# Altium project ESP32.PrjPcb (part 1 of 3)
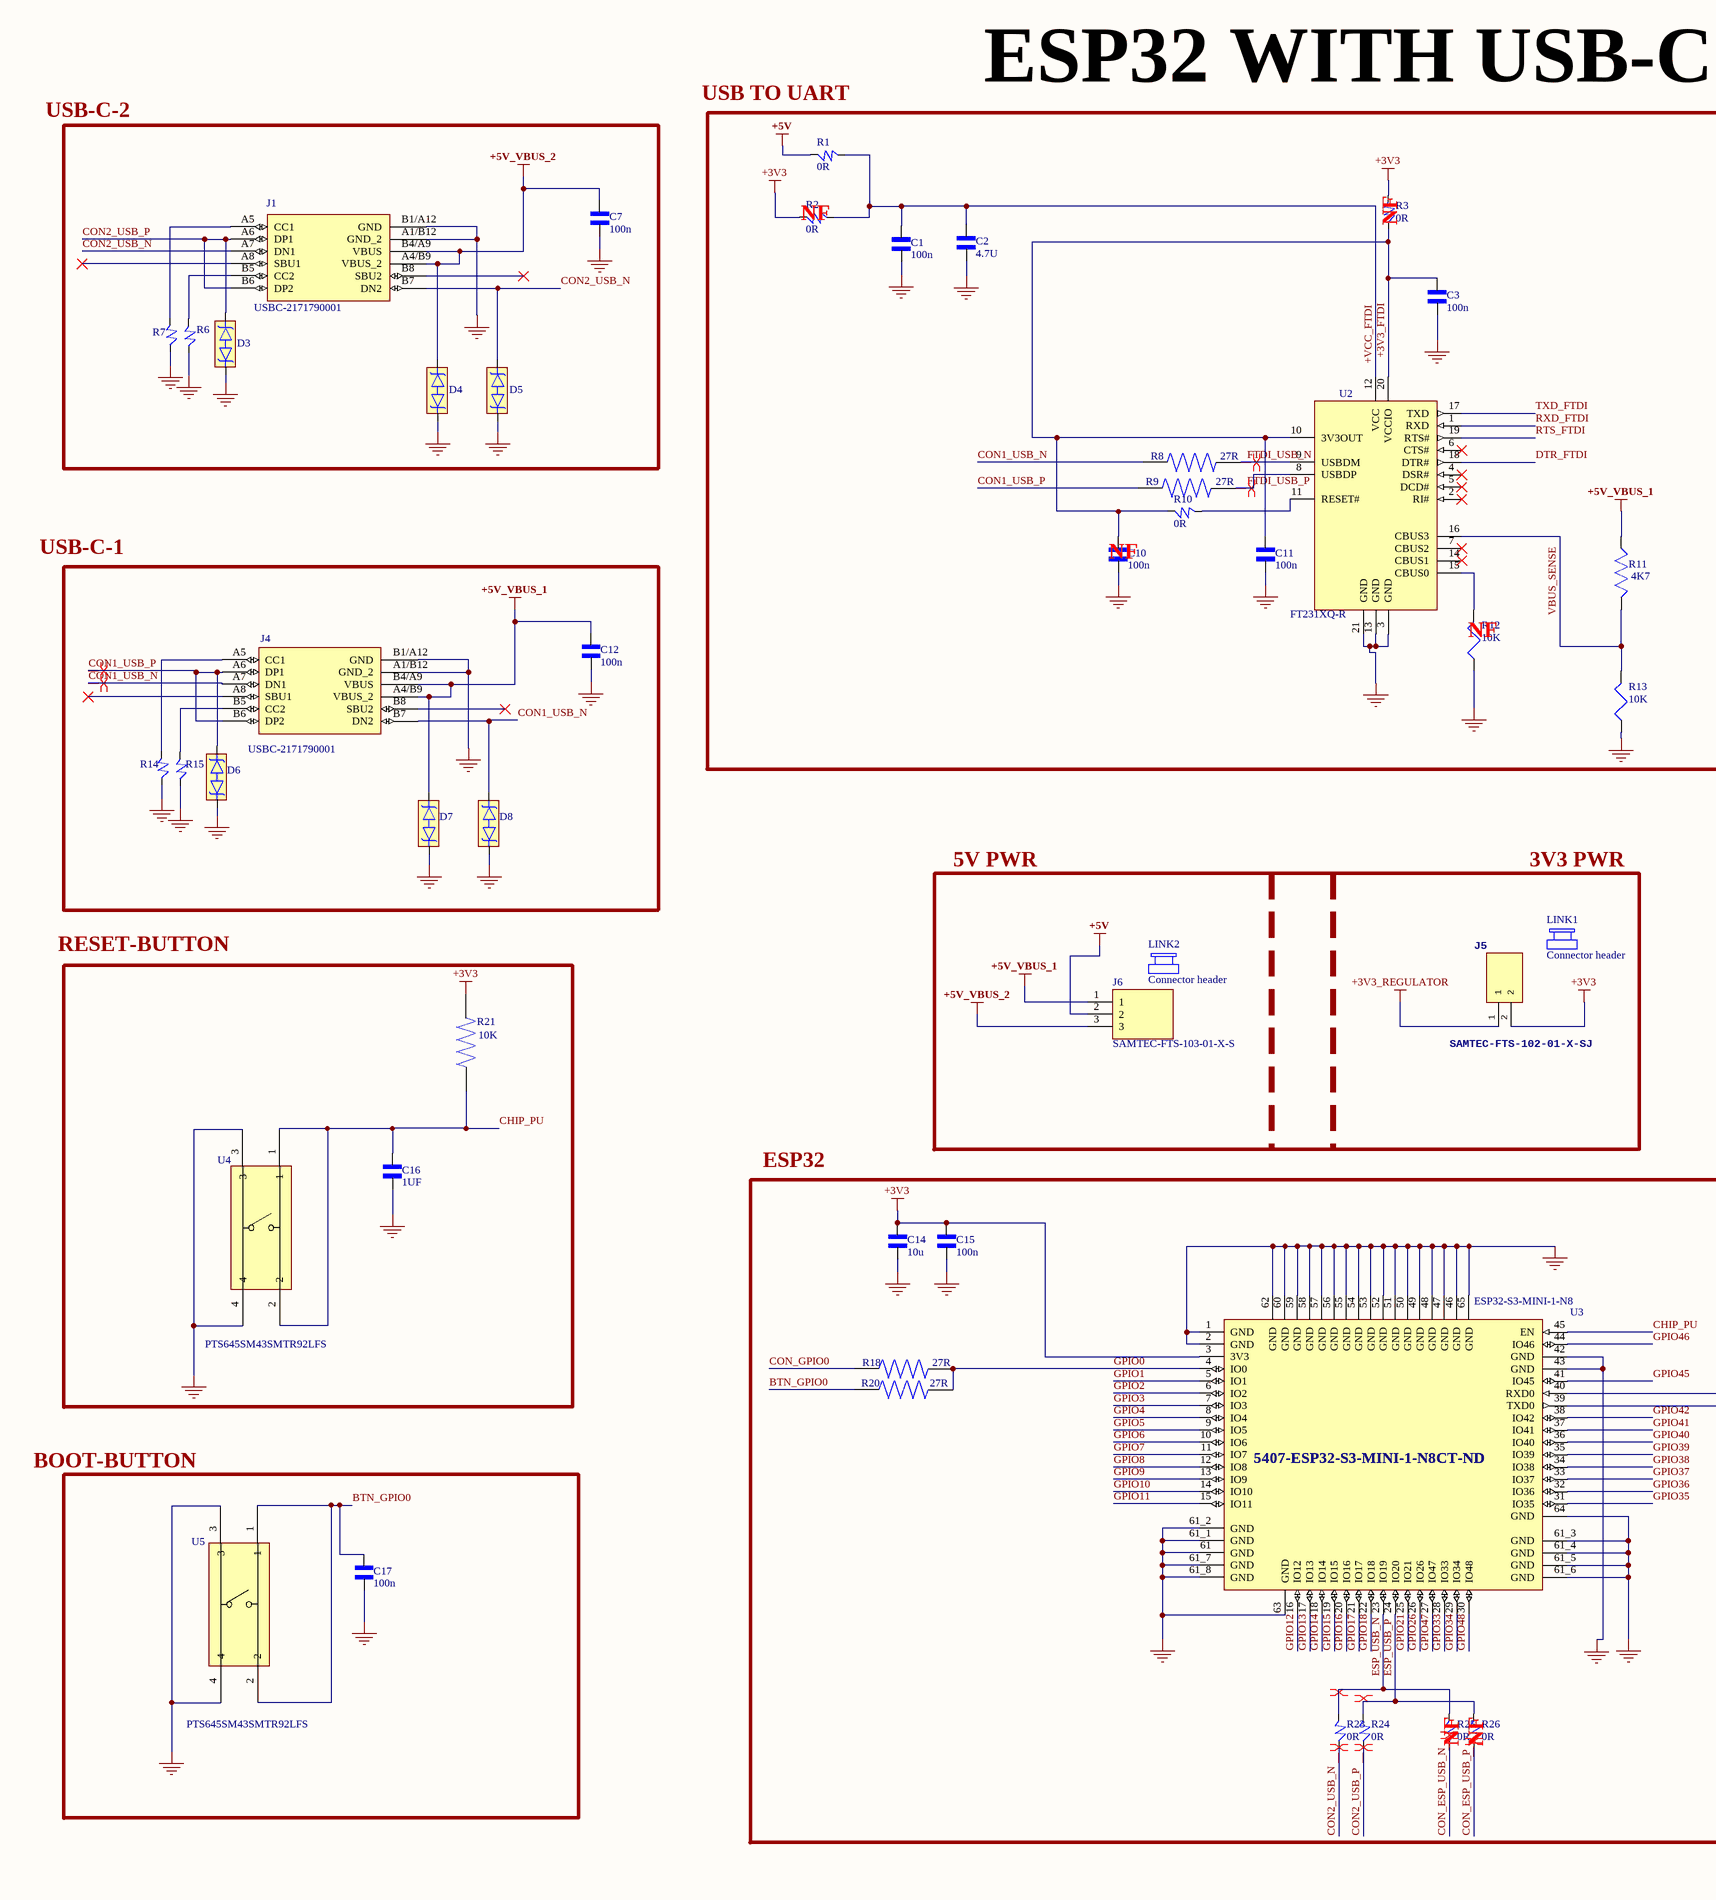
[diagram p0: Sheet1.SchDoc, left]
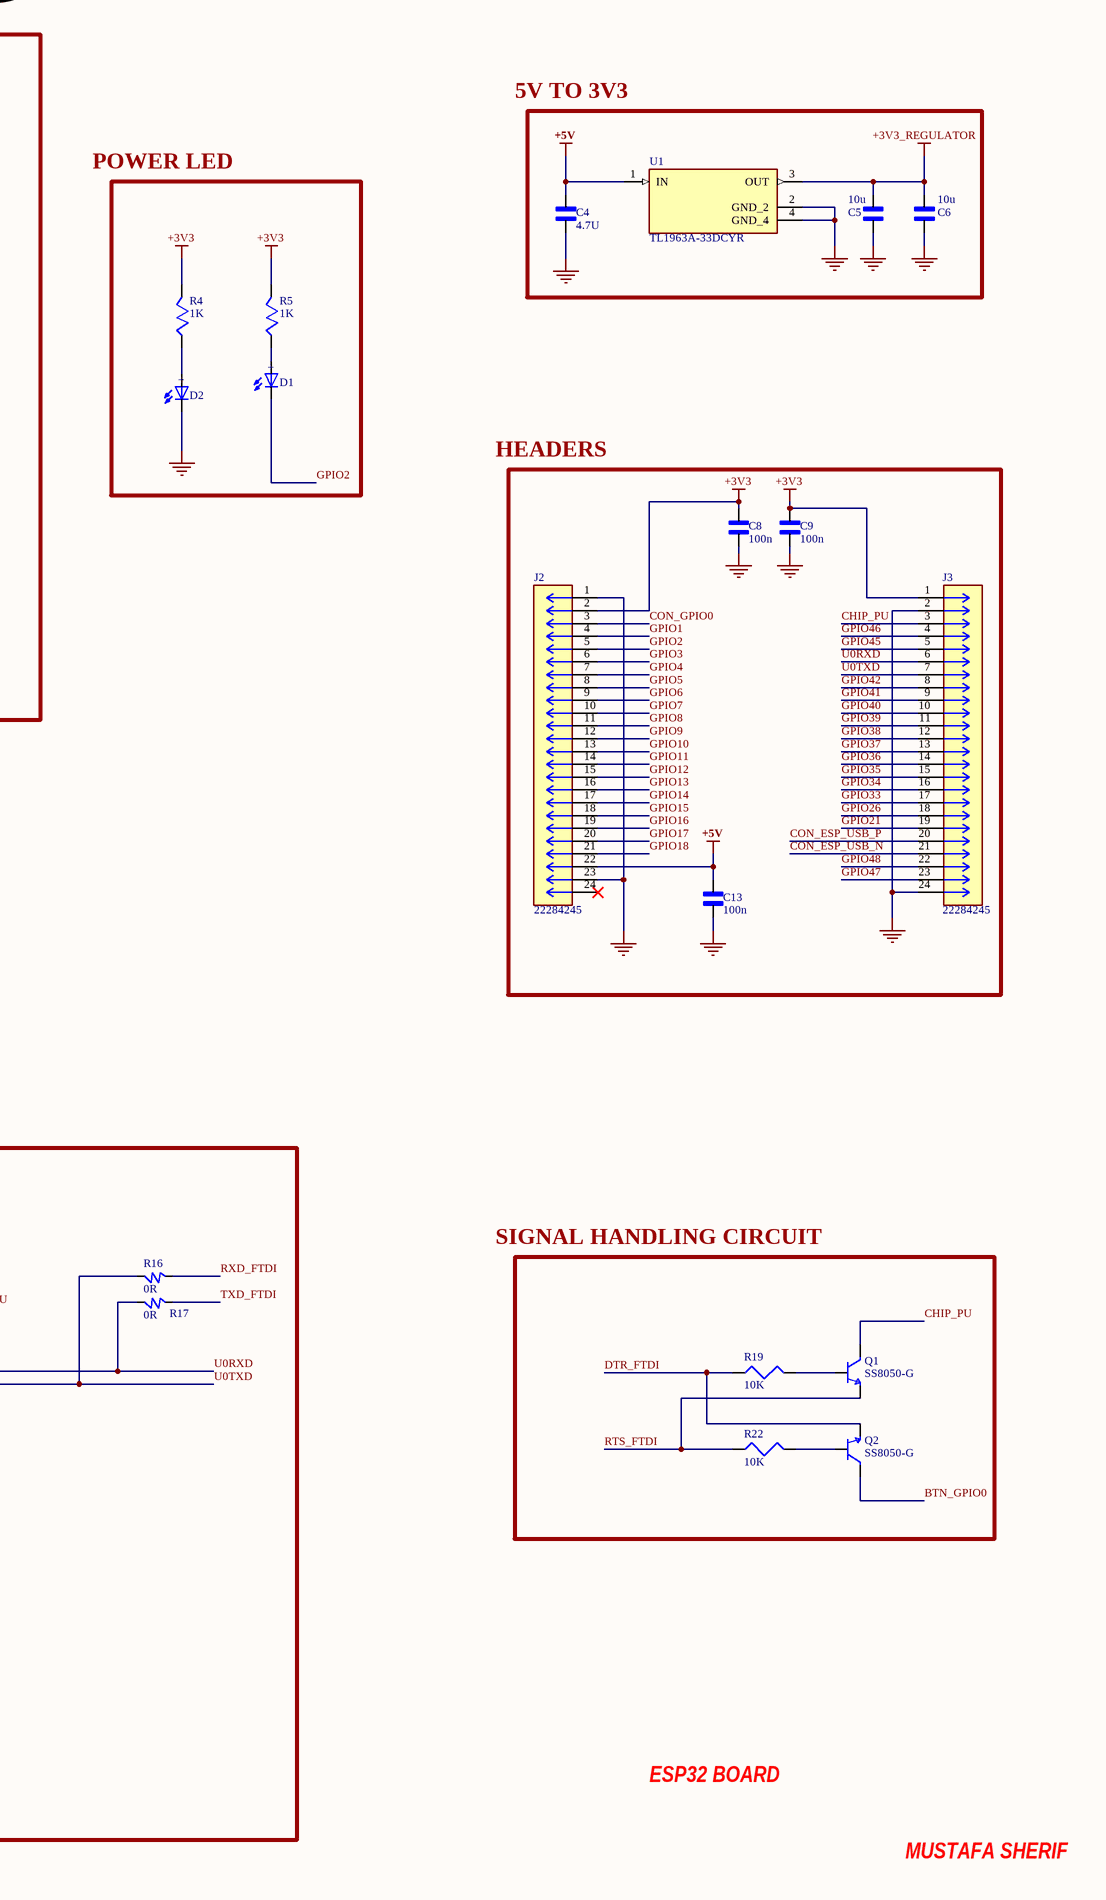
[diagram p1: Sheet1.SchDoc, right]
1 sheet, 66 parts. Net scope: global (net labels, ports and power ports of the same name join across sheets).
Board file: PCB1.PcbDoc

## Sheet Sheet1.SchDoc
size A2; SheetNumber: 1; SheetTotal: 1

### Parts
C1  100n  [CAPC1005X55N]
C2  4.7U  [CAPC1005X70N]
C3  100n  [CAPC1005X55N]
C4  4.7U  [CAPC1005X70N]
C5  10u  [CAPC1005X90N]
C6  10u  [CAPC1005X90N]
C7  100n  [CAPC1005X55N]
C8  100n  [CAPC1005X55N]
C9  100n  [CAPC1005X55N]
C10  100n  [CAPC1005X55N]
C11  100n  [CAPC1005X55N]
C12  100n  [CAPC1005X55N]
C13  100n  [CAPC1005X55N]
C14  10u  [CAPC1005X90N]
C15  100n  [CAPC1005X55N]
C16  1UF  [CAPC1005X65N]
C17  100n  [CAPC1005X55N]
D1  WL-SMCC_0402  [WL-SMCC_0402]  (value not drawn)
D2  WL-SMCC_0402  [WL-SMCC_0402]  (value not drawn)
D3  AQ3045-01ETG  [TVS_SOD882_LTF]  (value not drawn)
D4  AQ3045-01ETG  [TVS_SOD882_LTF]  (value not drawn)
D5  AQ3045-01ETG  [TVS_SOD882_LTF]  (value not drawn)
D6  AQ3045-01ETG  [TVS_SOD882_LTF]  (value not drawn)
D7  AQ3045-01ETG  [TVS_SOD882_LTF]  (value not drawn)
D8  AQ3045-01ETG  [TVS_SOD882_LTF]  (value not drawn)
J1  USBC-2171790001  [USBC-2171790001]
J2  22284245  [CONN_SD-42375-001_M295_24_MOL]
J3  22284245  [CONN_SD-42375-001_M295_24_MOL]
J4  USBC-2171790001  [USBC-2171790001]
J5  SAMTEC-FTS-102-01-X-SJ  [SAMTEC-FTS-102-01-X-S]
J6  SAMTEC-FTS-103-01-X-S  [SAMTEC-FTS-103-01-X-S]
LINK1  Connector header  (mechanical)
LINK2  Connector header  (mechanical)
Q1  SS8050-G  [TRANS_SS8050-G]
Q2  SS8050-G  [TRANS_SS8050-G]
R1  0R  [RESC1005X40]
R2  0R  [RESC1005X40]
R3  0R  [RESC1005X40]
R4  1K  [RESC1005X40N]
R5  1K  [RESC1005X40N]
R6  AC0402FR-075K1L  [5k1]  (value not drawn)
R7  AC0402FR-075K1L  [5k1]  (value not drawn)
R8  27R  [RES_RC0402_YAG]
R9  27R  [RES_RC0402_YAG]
R10  0R  [RESC1005X40]
R11  4K7  [RESC1005X40 - duplicate]
R12  10K  [RESC1005X37N]
R13  10K  [RESC1005X37N]
R14  AC0402FR-075K1L  [5k1]  (value not drawn)
R15  AC0402FR-075K1L  [5k1]  (value not drawn)
R16  0R  [RESC1005X40]
R17  0R  [RESC1005X40]
R18  27R  [RES_RC0402_YAG]
R19  10K  [RESC1005X37N]
R20  27R  [RES_RC0402_YAG]
R21  10K  [RESC1005X37N]
R22  10K  [RESC1005X37N]
R23  0R  [RESC1005X40]
R24  0R  [RESC1005X40]
R25  0R  [RESC1005X40]
R26  0R  [RESC1005X40]
U1  TL1963A-33DCYR  [VREG_TL1963A-33DCYR]
U2  FT231XQ-R  [QFN50P400X400X80-21N]
U3  ESP32-S3-MINI-1-N8  Supplier Part Number 1: 5407-ESP32-S3-MINI-1-N8CT-ND  [ESP32-S3-MINI-1-N8]
U4  PTS645SM43SMTR92LFS  [SWITCH_43SMTR92LFS]
U5  PTS645SM43SMTR92LFS  [SWITCH_43SMTR92LFS]

### Blocks framed on the sheet
ESP32 WITH USB-C: C1-C3 C10 C11 R1-R3 R8-R13 U2

### Nets
+3V3: C8.2 C9.2 C14.2 C15.2 J2.2 J3.1 J5.2 R2.1 R3.2 R4.2 R5.2 R21.2 U3.3(3V3)
+3V3_REGULATOR: C5.2 C6.2 J5.1 U1.3(OUT)
+5V: C4.2 C13.2 J2.22 J6.2 R1.1 U1.1(IN)
+5V_VBUS_1: C12.2 D7.1 J4.A4/B9(VBUS_2) J4.B4/A9(VBUS) J6.1 R11.2
+5V_VBUS_2: C7.2 D4.1 J1.A4/B9(VBUS_2) J1.B4/A9(VBUS) J6.3
GND: C1.1 C2.1 C3.1 C4.1 C5.1 C6.1 C7.1 C8.1 C9.1 C10.1 C11.1 C12.1 C13.1 C14.1 C15.1 C16.1 C17.1 D2.1(NEG) D3.2 D4.2 D5.2 D6.2 D7.2 D8.2 J1.A1/B12(GND_2) J1.B1/A12(GND) J2.1 J2.23 J3.2 J3.24 J4.A1/B12(GND_2) J4.B1/A12(GND) R6.1 R7.1 R12.1 R13.1 R14.1 R15.1 U1.2(GND_2) U1.4(GND_4) U2.3(GND) U2.13(GND) U2.21(GND) U3.1(GND) U3.2(GND) U3.42(GND) U3.43(GND) U3.46(GND) U3.47(GND) U3.48(GND) U3.49(GND) U3.50(GND) U3.51(GND) U3.52(GND) U3.53(GND) U3.54(GND) U3.55(GND) U3.56(GND) U3.57(GND) U3.58(GND) U3.59(GND) U3.60(GND) U3.61(GND) U3.61_1(GND) U3.61_2(GND) U3.61_3(GND) U3.61_4(GND) U3.61_5(GND) U3.61_6(GND) U3.61_7(GND) U3.61_8(GND) U3.62(GND) U3.63(GND) U3.64(GND) U3.65(GND) U4.3 U4.4 U5.3 U5.4
+3V3_FTDI: C3.2 C10.2 C11.2 R3.1 R10.1 U2.10(3V3OUT) U2.20(VCCIO)
+VCC_FTDI: C1.2 C2.2 R1.2 R2.2 U2.12(VCC)
BTN_GPIO0: C17.2 Q2.3(C) R20.1 U5.1 U5.2
CHIP_PU: C16.2 J3.3 Q1.3(C) R21.1 U3.45(EN) U4.1 U4.2
CON1_USB_N: D8.1 J4.A7(DN1) J4.B7(DN2) R8.1
CON1_USB_P: D6.1 J4.A6(DP1) J4.B6(DP2) R9.1
CON2_USB_N: D5.1 J1.A7(DN1) J1.B7(DN2) R23.1
CON2_USB_P: D3.1 J1.A6(DP1) J1.B6(DP2) R24.1
CON_ESP_USB_N: J3.21 R25.1
CON_ESP_USB_P: J3.20 R26.1
CON_GPIO0: J2.3 R18.1
DTR_FTDI: Q2.2(E) R19.1 U2.18(DTR#)
ESP_USB_N: R23.2 R25.2 U3.23(IO19)
ESP_USB_P: R24.2 R26.2 U3.24(IO20)
FTDI_USB_N: R8.2 U2.9(USBDM)
FTDI_USB_P: R9.2 U2.8(USBDP)
GPIO0: R18.2 R20.2 U3.4(IO0)
GPIO1: J2.4 U3.5(IO1)
GPIO2: D1.1(NEG) J2.5 U3.6(IO2)
GPIO3: J2.6 U3.7(IO3)
GPIO4: J2.7 U3.8(IO4)
GPIO5: J2.8 U3.9(IO5)
GPIO6: J2.9 U3.10(IO6)
GPIO7: J2.10 U3.11(IO7)
GPIO8: J2.11 U3.12(IO8)
GPIO9: J2.12 U3.13(IO9)
GPIO10: J2.13 U3.14(IO10)
GPIO11: J2.14 U3.15(IO11)
GPIO12: J2.15 U3.16(IO12)
GPIO13: J2.16 U3.17(IO13)
GPIO14: J2.17 U3.18(IO14)
GPIO15: J2.18 U3.19(IO15)
GPIO16: J2.19 U3.20(IO16)
GPIO17: J2.20 U3.21(IO17)
GPIO18: J2.21 U3.22(IO18)
GPIO21: J3.19 U3.25(IO21)
GPIO26: J3.18 U3.26(IO26)
GPIO33: J3.17 U3.28(IO33)
GPIO34: J3.16 U3.29(IO34)
GPIO35: J3.15 U3.31(IO35)
GPIO36: J3.14 U3.32(IO36)
GPIO37: J3.13 U3.33(IO37)
GPIO38: J3.12 U3.34(IO38)
GPIO39: J3.11 U3.35(IO39)
GPIO40: J3.10 U3.36(IO40)
GPIO41: J3.9 U3.37(IO41)
GPIO42: J3.8 U3.38(IO42)
GPIO45: J3.5 U3.41(IO45)
GPIO46: J3.4 U3.44(IO46)
GPIO47: J3.23 U3.27(IO47)
GPIO48: J3.22 U3.30(IO48)
RTS_FTDI: Q1.2(E) R22.1 U2.19(RTS#)
RXD_FTDI: R16.2 U2.1(RXD)
TXD_FTDI: R17.2 U2.17(TXD)
U0RXD: J3.6 R17.1 U3.40(RXD0)
U0TXD: J3.7 R16.1 U3.39(TXD0)
VBUS_SENSE: R11.1 R13.2 U2.16(CBUS3)
NetD1_2: D1.2(POS) R5.1
NetD2_2: D2.2(POS) R4.1
NetJ1_A5: J1.A5(CC1) R7.2
NetJ1_B5: J1.B5(CC2) R6.2
NetJ4_A5: J4.A5(CC1) R14.2
NetJ4_B5: J4.B5(CC2) R15.2
NetQ1_1: Q1.1(B) R19.2
NetQ2_1: Q2.1(B) R22.2
NetR10_2: R10.2 U2.11(RESET#)
NetR12_2: R12.2 U2.15(CBUS0)

Not connected (* = marked no-connect by the designer): J1 A8(SBU1)* B8(SBU2)*; J2 24*; J4 A8(SBU1)* B8(SBU2)*; U2 2(RI#)* 4(DSR#)* 5(DCD#)* 6(CTS#)* 7(CBUS2)* 14(CBUS1)*

### Layout directives
differential pair: CON1_USB_N, CON1_USB_P, CON2_USB_N, CON2_USB_P, CON_ESP_USB_N, CON_ESP_USB_P, ESP_USB_N, ESP_USB_P, FTDI_USB_N, FTDI_USB_P

### Notes on the sheet
- USB-C-2
- (near R1) USB TO UART
- 5V TO 3V3
- (near R2) NF
- (near R3) NF
- POWER LED
- USB-C-1
- (near C10) NF
- HEADERS
- (near R12) NF
- 5V PWR
- 3V3 PWR
- RESET-BUTTON
- ESP32
- SIGNAL HANDLING CIRCUIT
- BOOT-BUTTON
- (near R25) NF
- (near R26) NF
- ESP32 BOARD
- MUSTAFA SHERIF
- (in symbol WL-SMCC_0402) +